# EAGLE schematic untitled (EAGLE 9.5.2)
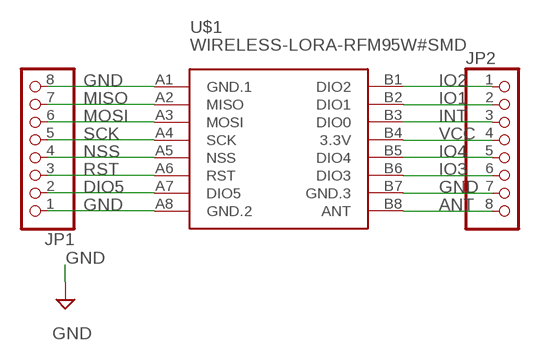
[diagram p0: schematic, sheet 1]

## Parts
JP1  PINHD-1X8  [1X08]
JP2  PINHD-1X8  [1X08]
U$1  WIRELESS-LORA-RFM95W#SMD  [WIRELESS-LORA-RFM95W#SMD]

## Nets
ANT: JP2.8 U$1.B8(ANT)
DIO5: JP1.2 U$1.A7(DIO5)
GND: JP1.1 JP1.8 JP2.7 U$1.A1(GND.1) U$1.A8(GND.2) U$1.B7(GND.3)
INT: JP2.3 U$1.B3(DIO0)
IO1: JP2.2 U$1.B2(DIO1)
IO2: JP2.1 U$1.B1(DIO2)
IO3: JP2.6 U$1.B6(DIO3)
IO4: JP2.5 U$1.B5(DIO4)
MISO: JP1.7 U$1.A2(MISO)
MOSI: JP1.6 U$1.A3(MOSI)
NSS: JP1.4 U$1.A5(NSS)
RST: JP1.3 U$1.A6(RST)
SCK: JP1.5 U$1.A4(SCK)
VCC: JP2.4 U$1.B4(3.3V)

## Library data of the parts
JP1 JP2 = pinhead:PINHD-1X8: PIN HEADER
U$1 = dht22:WIRELESS-LORA-RFM95W: 868/915 MHz LoRa Radio Transceiver Module based on SX1276 chip Click here to find device on ebay.com <http://www.ebay.com/sch/RFM95W+transceiver>